# Altium schematic sheet FPGA_51_C_165B_ASM_Buzzer.SchDoc
size B; Organization: Altium Limited; Address1: L3, 12a Rodborough Rd; Address2: Frenchs Forest; Address3: NSW; Address4: Australia 2086; DocumentNumber: 1; SheetNumber: 1; SheetTotal: 3
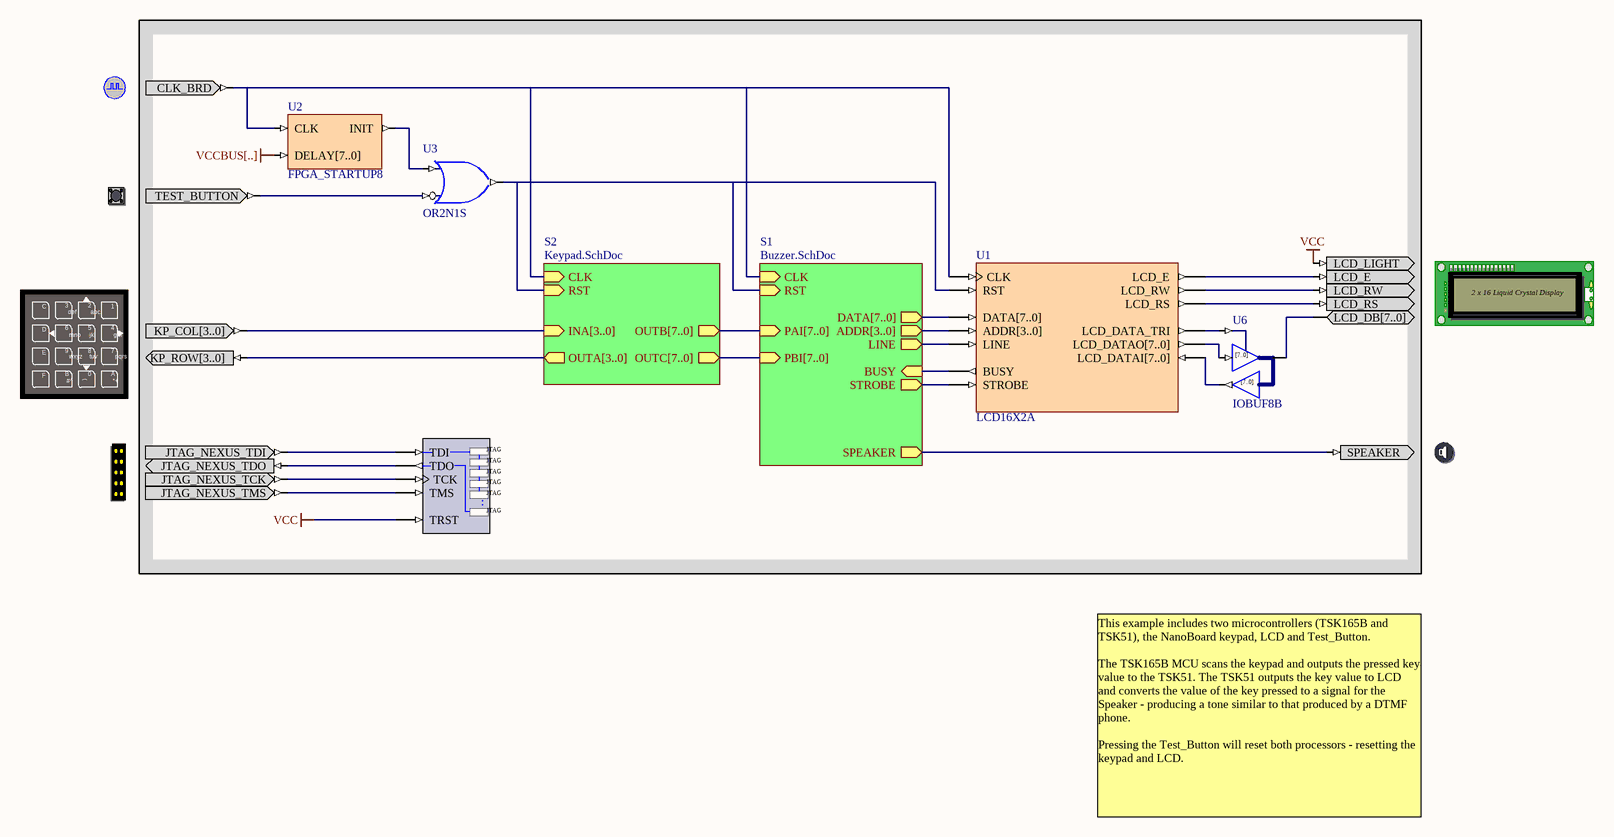
[diagram p0: FPGA_51_C_165B_ASM_Buzzer.SchDoc]

## Parts
(Parts that share a designator on the sheet are numbered #1, #2 ... from top to bottom, then left to right.)
?#1  CLOCK_BOARD  (value not drawn)
?#2  TEST_BUTTON  (value not drawn)
?#3  LCD  (value not drawn)
?#4  KEYPAD  (value not drawn)
?#5  NEXUS_JTAG_CONNECTOR  (value not drawn)
?#6  SPEAKER  (value not drawn)
NEXUS_JTAG_PORT  NEXUS_JTAG_PORT  (value not drawn)
U1  LCD16X2A
U2  FPGA_STARTUP8
U3  OR2N1S
U6  IOBUF8B

## Sub-sheets
S1 = Buzzer.SchDoc: CLK (in), RST (in), PAI[7..0] (in), PBI[7..0] (in), DATA[7..0] (out), ADDR[3..0] (out), LINE (out), BUSY (in), STROBE (out), SPEAKER (out)
S2 = Keypad.SchDoc: CLK (in), OUTA[3..0] (out), INA[3..0] (in), OUTB[7..0] (out), RST (in), OUTC[7..0] (out)

## Nets
VCC: ?#3.LCD_LIGHT NEXUS_JTAG_PORT.TRST
VCCBUS[..]: U2.DELAY[7..0]
Net?#1_CLK_BRD: ?#1.CLK_BRD U1.CLK U2.CLK ; sheet S1/CLK, sheet S2/CLK
Net?#2_TEST_BUTTON: ?#2.TEST_BUTTON U3.I0
Net?#3_LCD_DB[7..0]: ?#3.LCD_DB[7..0] U6.IO[7..0]
Net?#3_LCD_E: ?#3.LCD_E U1.LCD_E
Net?#3_LCD_RS: ?#3.LCD_RS U1.LCD_RS
Net?#3_LCD_RW: ?#3.LCD_RW U1.LCD_RW
Net?#4_KP_COL[3..0]: ?#4.KP_COL[3..0] ; sheet S2/INA[3..0]
Net?#4_KP_ROW[3..0]: ?#4.KP_ROW[3..0] ; sheet S2/OUTA[3..0]
Net?#5_JTAG_NEXUS_TCK: ?#5.JTAG_NEXUS_TCK NEXUS_JTAG_PORT.TCK
Net?#5_JTAG_NEXUS_TDI: ?#5.JTAG_NEXUS_TDI NEXUS_JTAG_PORT.TDI
Net?#5_JTAG_NEXUS_TDO: ?#5.JTAG_NEXUS_TDO NEXUS_JTAG_PORT.TDO
Net?#5_JTAG_NEXUS_TMS: ?#5.JTAG_NEXUS_TMS NEXUS_JTAG_PORT.TMS
Net?#6_SPEAKER: ?#6.SPEAKER ; sheet S1/SPEAKER
NetU1_ADDR[3..0]: U1.ADDR[3..0] ; sheet S1/ADDR[3..0]
NetU1_BUSY: U1.BUSY ; sheet S1/BUSY
NetU1_DATA[7..0]: U1.DATA[7..0] ; sheet S1/DATA[7..0]
NetU1_LCD_DATA_TRI: U1.LCD_DATA_TRI U6.T
NetU1_LCD_DATAI[7..0]: U1.LCD_DATAI[7..0] U6.O[7..0]
NetU1_LCD_DATAO[7..0]: U1.LCD_DATAO[7..0] U6.I[7..0]
NetU1_LINE: U1.LINE ; sheet S1/LINE
NetU1_RST: U1.RST U3.O ; sheet S1/RST, sheet S2/RST
NetU1_STROBE: U1.STROBE ; sheet S1/STROBE
NetU2_INIT: U2.INIT U3.I1

## Buses and harness runs
bus sheet S1/PAI[7..0] = sheet S2/OUTB[7..0]
bus sheet S1/PBI[7..0] = sheet S2/OUTC[7..0]

## Notes on the sheet
- This example includes two microcontrollers (TSK165B and TSK51), the NanoBoard keypad, LCD and Test_Button.
  The TSK165B MCU scans the keypad and outputs the pressed key value to the TSK51. The TSK51 outputs the key value to LCD and converts the value of the key pressed to a signal for the Speaker - producing a tone similar to that produced by a DTMF phone.
  Pressing the Test_Button will reset both processors - resetting the keypad and LCD.
- Title
- Size:
- Date:
- B
- Number:
- Time:
- Revision:
- Sheet
- of
- File:
- (in symbol IOBUF8B) [7..0]
- (in symbol KEYPAD) C; 3; 2; 1; def; abc; 6; 5; 4; D; mno; jkl; ghi; E; 9; 8; 7; wxyz; tuv; pqrs; F; B; 0; A; #^; (; *+
- (in symbol LCD) 2 x 16 Liquid Crystal Display
- (in symbol NEXUS_JTAG_PORT) JTAG; .

## Library data of the parts
?#1 = CLOCK_BOARD: Global System Clock Supply; PortComponent: True; Published: 19-Nov-2003; Publisher: Altium Limited
?#2 = TEST_BUTTON: Test Button; PortComponent: True; Published: 19-Nov-2003; Publisher: Altium Limited
?#3 = LCD: Liquid Crystal Display; PortComponent: True; Published: 19-Nov-2003; Publisher: Altium Limited
?#4 = KEYPAD: Key Pad; PortComponent: True; Published: 19-Nov-2003; Publisher: Altium Limited
?#5 = NEXUS_JTAG_CONNECTOR: JTAG Port; PortComponent: True; Published: 19-Nov-2003; Publisher: Altium Limited
?#6 = SPEAKER: Sound interface; PortComponent: True; Published: 19-Nov-2003; Publisher: Altium Limited
NEXUS_JTAG_PORT = NEXUS_JTAG_PORT: Soft Nexus-Chain Connector; NEXUS_JTAG_CONNECTOR: True; Published: 18-Dec-2003; Publisher: Altium Limited
U1 = LCD16X2A: LCD Controller; Published: 5/01/2004; Publisher: Altium Hobart Technology Centre; Core Revision: 1.00.00
U2 = FPGA_STARTUP8: FPGA Startup With 8 Bit Delay; Published: 21/01/2004; Publisher: Altium Hobart Technology Centre; Core Revision: 1.00.00
U3 = OR2N1S: 2-Input OR Gate with Active Low A Input, Single Pin Version; Xilinx Equivalent: OR2B1; ArchiveName: GENERIC; Published: 18-Dec-2003; Publisher: Altium Limited; Core Revision: 1.00.00
U6 = IOBUF8B: 8-Bit Input/Output Buffer, Bus Version; ArchiveName: GENERIC; Published: 18-Dec-2003; Publisher: Altium Limited; Core Revision: 1.00.00